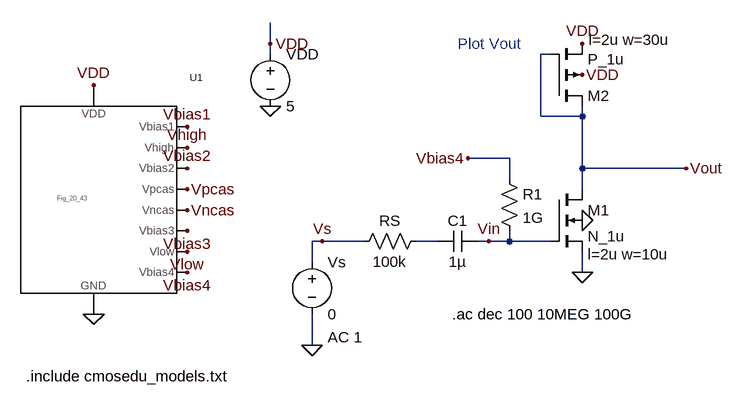
[diagram p0: schematic Fig21_9.asc]
Fig21_9.asc, the LTspice schematic file:
Version 4
SHEET 1 1792 680
WIRE 1072 -304 1072 -336
WIRE 1072 -288 1072 -304
WIRE 1504 -288 1488 -288
WIRE 1488 -192 1488 -288
WIRE 1552 -192 1552 -208
WIRE 1552 -192 1488 -192
WIRE 1440 -128 1376 -128
WIRE 1552 -112 1552 -192
WIRE 1712 -112 1552 -112
WIRE 1440 -96 1440 -128
WIRE 1552 -80 1552 -112
WIRE 1152 0 1136 0
WIRE 1216 0 1152 0
WIRE 1328 0 1296 0
WIRE 1408 0 1392 0
WIRE 1440 0 1440 -16
WIRE 1440 0 1408 0
WIRE 1504 0 1440 0
WIRE 1136 32 1136 0
WIRE 1552 48 1552 16
WIRE 1136 160 1136 112
FLAG 1072 -208 0
FLAG 1072 -304 VDD
FLAG 1552 -32 0
FLAG 1552 48 0
FLAG 1552 -304 VDD
FLAG 1552 -256 VDD
FLAG 1376 -128 Vbias4
FLAG 800 -240 VDD
FLAG 800 112 0
FLAG 944 -176 Vbias1
FLAG 944 -144 Vhigh
FLAG 944 -112 Vbias2
FLAG 944 -16 Vbias3
FLAG 944 -80 Vpcas
FLAG 944 -48 Vncas
FLAG 944 48 Vbias4
FLAG 944 16 Vlow
FLAG 1712 -112 Vout
FLAG 1136 160 0
FLAG 1408 0 Vin
FLAG 1152 0 Vs
SYMBOL voltage 1072 -304 R0
WINDOW 123 0 0 Left 2
WINDOW 39 0 0 Left 2
SYMATTR InstName VDD
SYMATTR Value 5
SYMBOL nmos4 1504 -80 R0
WINDOW 123 56 100 Left 2
SYMATTR Value2 l=2u w=10u
SYMATTR InstName M1
SYMATTR Value N_1u
SYMBOL pmos4 1504 -208 M180
WINDOW 123 58 102 Left 2
WINDOW 0 56 16 Left 2
SYMATTR Value2 l=2u w=30u
SYMATTR InstName M2
SYMATTR Value P_1u
SYMBOL Fig_20_43 800 -64 R0
SYMATTR InstName U1
SYMBOL res 1424 -112 R0
SYMATTR InstName R1
SYMATTR Value 1G
SYMBOL cap 1392 16 M270
WINDOW 0 32 32 VTop 2
WINDOW 3 0 32 VBottom 2
SYMATTR InstName C1
SYMATTR Value 1µ
SYMBOL voltage 1136 16 R0
WINDOW 123 24 132 Left 2
WINDOW 39 0 0 Left 2
SYMATTR Value2 AC 1
SYMATTR InstName Vs
SYMATTR Value 0
SYMBOL res 1200 16 R270
WINDOW 0 32 56 VTop 2
WINDOW 3 0 56 VBottom 2
SYMATTR InstName RS
SYMATTR Value 100k
TEXT 696 208 Left 2 !.include cmosedu_models.txt
TEXT 1360 -304 Left 2 ;Plot Vout
TEXT 1352 112 Left 2 !.ac dec 100 10MEG 100G

The netlist it stands for:
* Fig21_9.asc
VDD VDD 0 5
M1 Vout Vin 0 0 N_1u l=2u w=10u
M2 Vout Vout VDD VDD P_1u l=2u w=30u
XU1 Vbias1 Vhigh Vbias2 Vpcas Vncas Vbias3 Vlow Vbias4 VDD 0 Fig_20_43  ; pins Vbias1 Vhigh Vbias2 Vpcas Vncas Vbias3 Vlow Vbias4 VDD GND
R1 Vbias4 Vin 1G
C1 Vin N001 1µ
Vs Vs 0 0 AC 1
RS Vs N001 100k
.model NMOS NMOS
.model PMOS PMOS
.lib standard.mos
.include cmosedu_models.txt
* Plot Vout
.ac dec 100 10MEG 100G
.backanno
.end